# EAGLE design Cargador_RasPi3HAT_CamSlot_v1.1 (EAGLE 9.3.0)
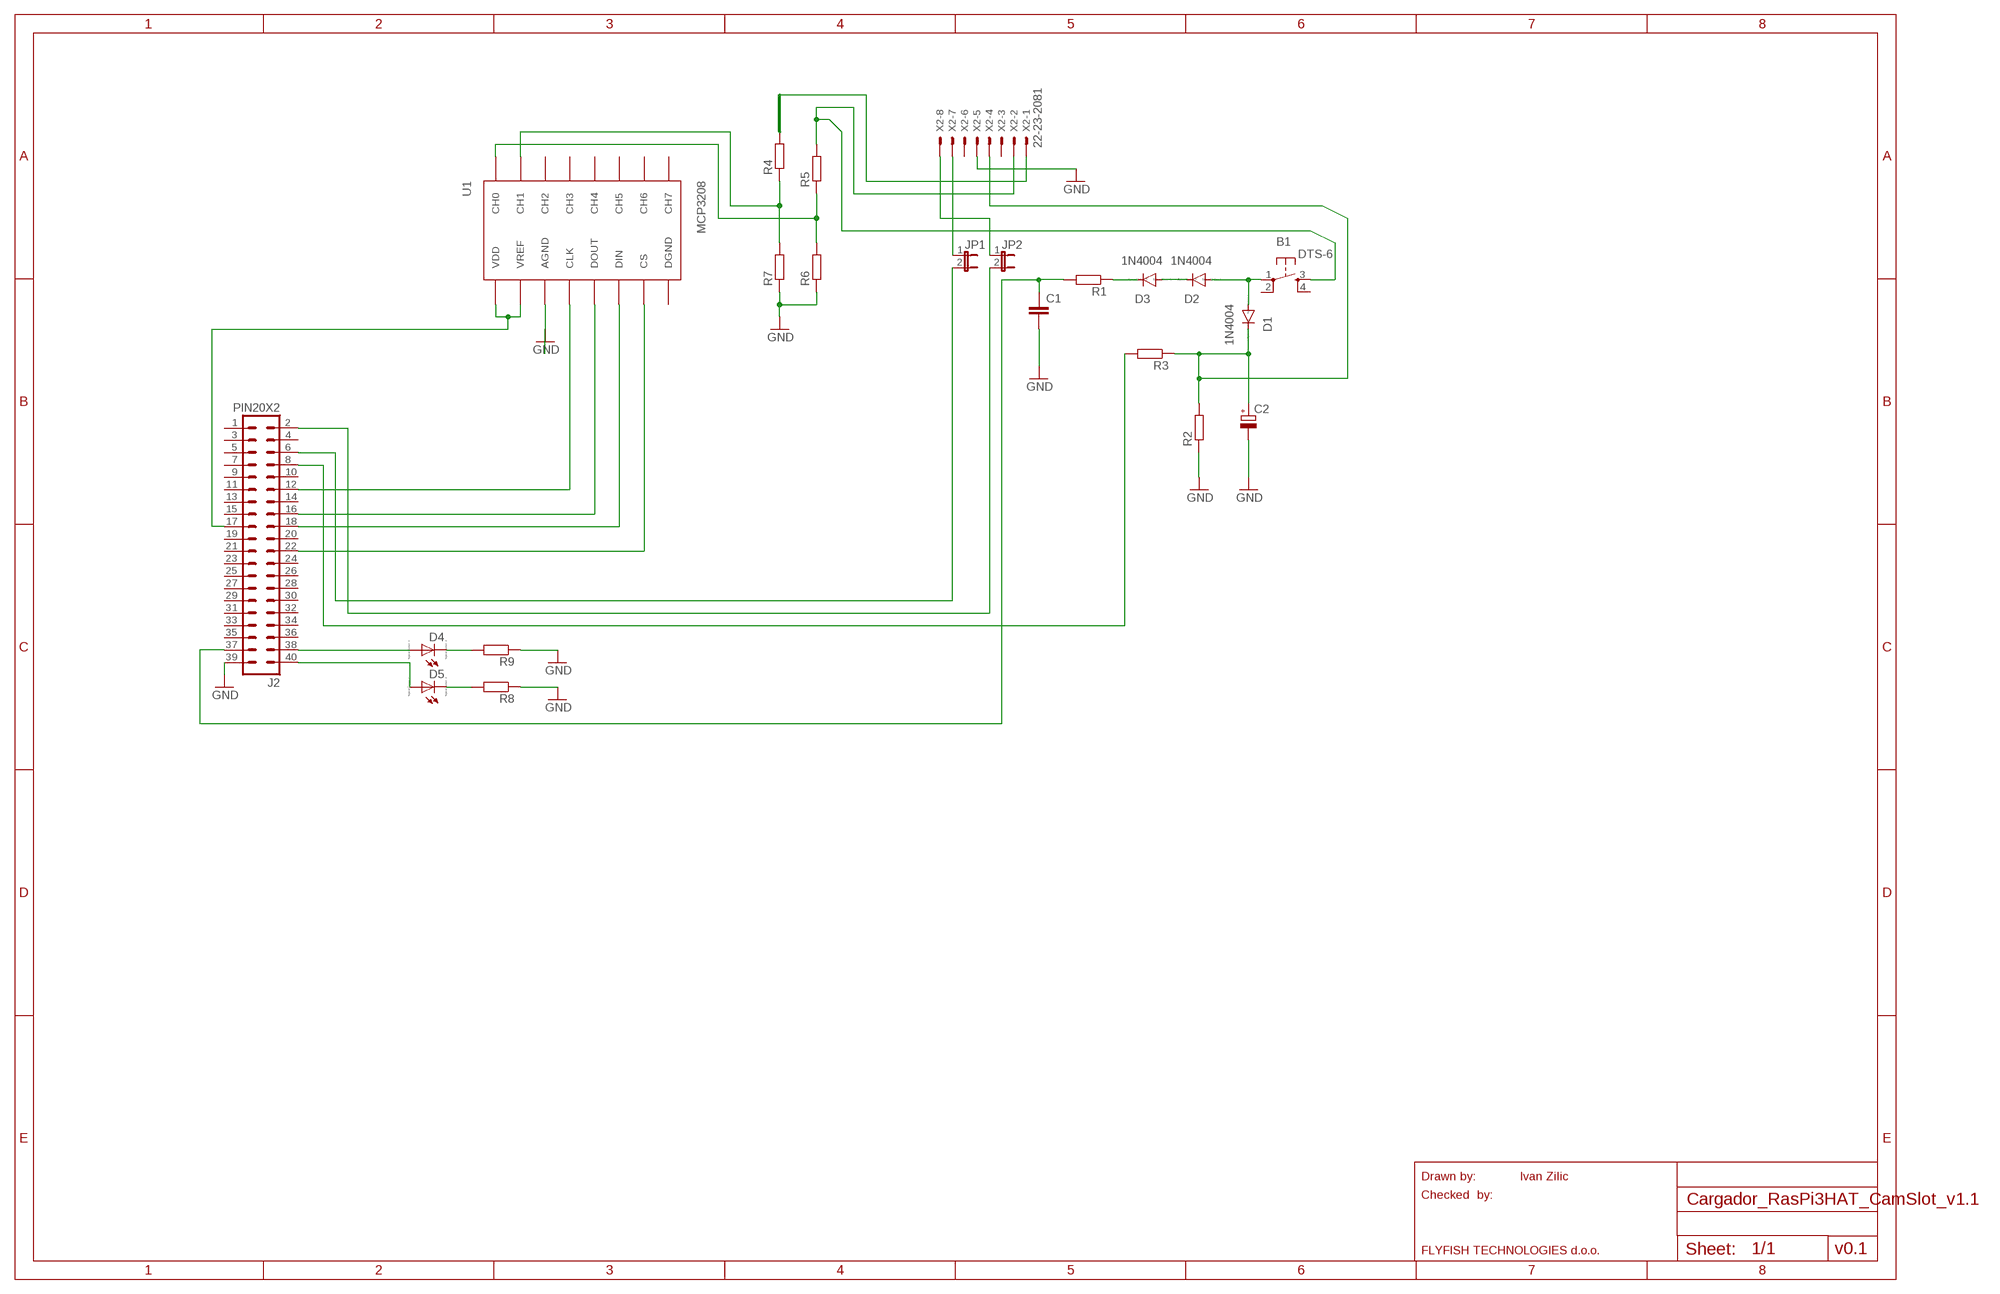
[diagram p0: schematic, sheet 1]

## Parts
B1  DTS-6  [DTS-6]
C1  C2.5/2  [C2.5-2]
C2  CPOL-EUE5-4  [E5-4]
D1  1N4004  [DO41-10]
D2  1N4004  [DO41-10]
D3  1N4004  [DO41-10]
D4  LED_ELD260  [LED_LD260]
D5  LED_ELD260  [LED_LD260]
J2  PIN20X2  [PIN_20X2]
JP1  JP1E  [JP1]
JP2  JP1E  [JP1]
R1  R-EU_0207/10  [0207/10]
R2  R-EU_0207/10  [0207/10]
R3  R-EU_0207/10  [0207/10]
R4  R-EU_0207/10  [0207/10]
R5  R-EU_0207/10  [0207/10]
R6  R-EU_0207/10  [0207/10]
R7  R-EU_0207/10  [0207/10]
R8  R-EU_0207/10  [0207/10]
R9  R-EU_0207/10  [0207/10]
U1  MCP3208  [DIL16]
X2  22-23-2081  [22-23-2081]

## Nets
GND [GND]: C1.2 C2.- J2.39 R2.1 R6.1 R7.1 R8.1 R9.1 U1.AGND X2.5
N$1: J2.6 JP1.2
N$2: J2.8 R3.2
N$3: D4.K(C) R9.2
N$4: D5.K(C) R8.2
N$5: D3.C R1.1
N$6: D4.A J2.38
N$7: D5.A J2.40
N$8: J2.22 U1.CS
N$9: J2.16 U1.DOUT
N$10: J2.18 U1.DIN
N$11 [GND]: J2.12 U1.CLK
N$12: J2.17 U1.VDD U1.VREF
N$13 [GND]: R4.1 R7.2 U1.CH1
N$14: R5.1 R6.2 U1.CH0
N$15: R4.2 X2.1
N$16 [GND]: B1.3 R5.2 X2.2
N$17: JP1.1 X2.7
N$19: JP2.1 X2.8
N$20: J2.2 JP2.2
N$21: C1.1 J2.37 R1.2
N$23: D2.C D3.A
N$24 [GND]: B1.1 D1.A D2.A
N$26 [GND]: C2.+ D1.C R2.2 R3.1 X2.4
Unconnected: B1.2 B1.4 J2.1 J2.3 J2.4 J2.5 J2.7 J2.9 J2.10 J2.11 J2.13 J2.14 J2.15 J2.19 J2.20 J2.21 J2.23 J2.24 J2.25 J2.26 J2.27 J2.28 J2.29 J2.30 J2.31 J2.32 J2.33 J2.34 J2.35 J2.36 U1.CH2 U1.CH3 U1.CH4 U1.CH5 U1.CH6 U1.CH7 X2.3 X2.6

## Notes on the sheet
- Drawn by: | Ivan Zilic
- Checked  by:
- FLYFISH TECHNOLOGIES d.o.o. | v0.1

## Power pins joined to a net without a drawn wire
DGND: U1.DGND

## Library data of the parts
B1 = switch-tact:DTS-6
C1 = capacitor-wima:C: CAPACITOR naming: grid - package width
C2 = rcl:CPOL-EU: POLARIZED CAPACITOR, European symbol; SPICEPREFIX: C
D1-D3 = diode:1N4004: DIODE general purpose rectifier, 1 A
D4 D5 = eagle-ltspice:LED_E: LED Source: http://www.osram.convergy.de Source: www.luxeon.com Source: www.kingbright.com; SPICEMODEL: NONE; SPICEPREFIX: D; SPICETYPE: diode
J2 = FLYFISH:PIN20X2
JP1 JP2 = jumper:JP1E: JUMPER
R1-R9 = rcl:R-EU_: RESISTOR, European symbol; SPICEPREFIX: R
U1 = mcp3208:MCP3208
X2 = con-molex:22-23-2081: .100" (2.54mm) Center Header - 8 Pin; MF: MOLEX; MPN: 22-23-2081; OC_FARNELL: 1756826; OC_NEWARK: 01C7592

## Net classes
1 GND: width 0.254 mm, clearance 0.127 mm

## Board
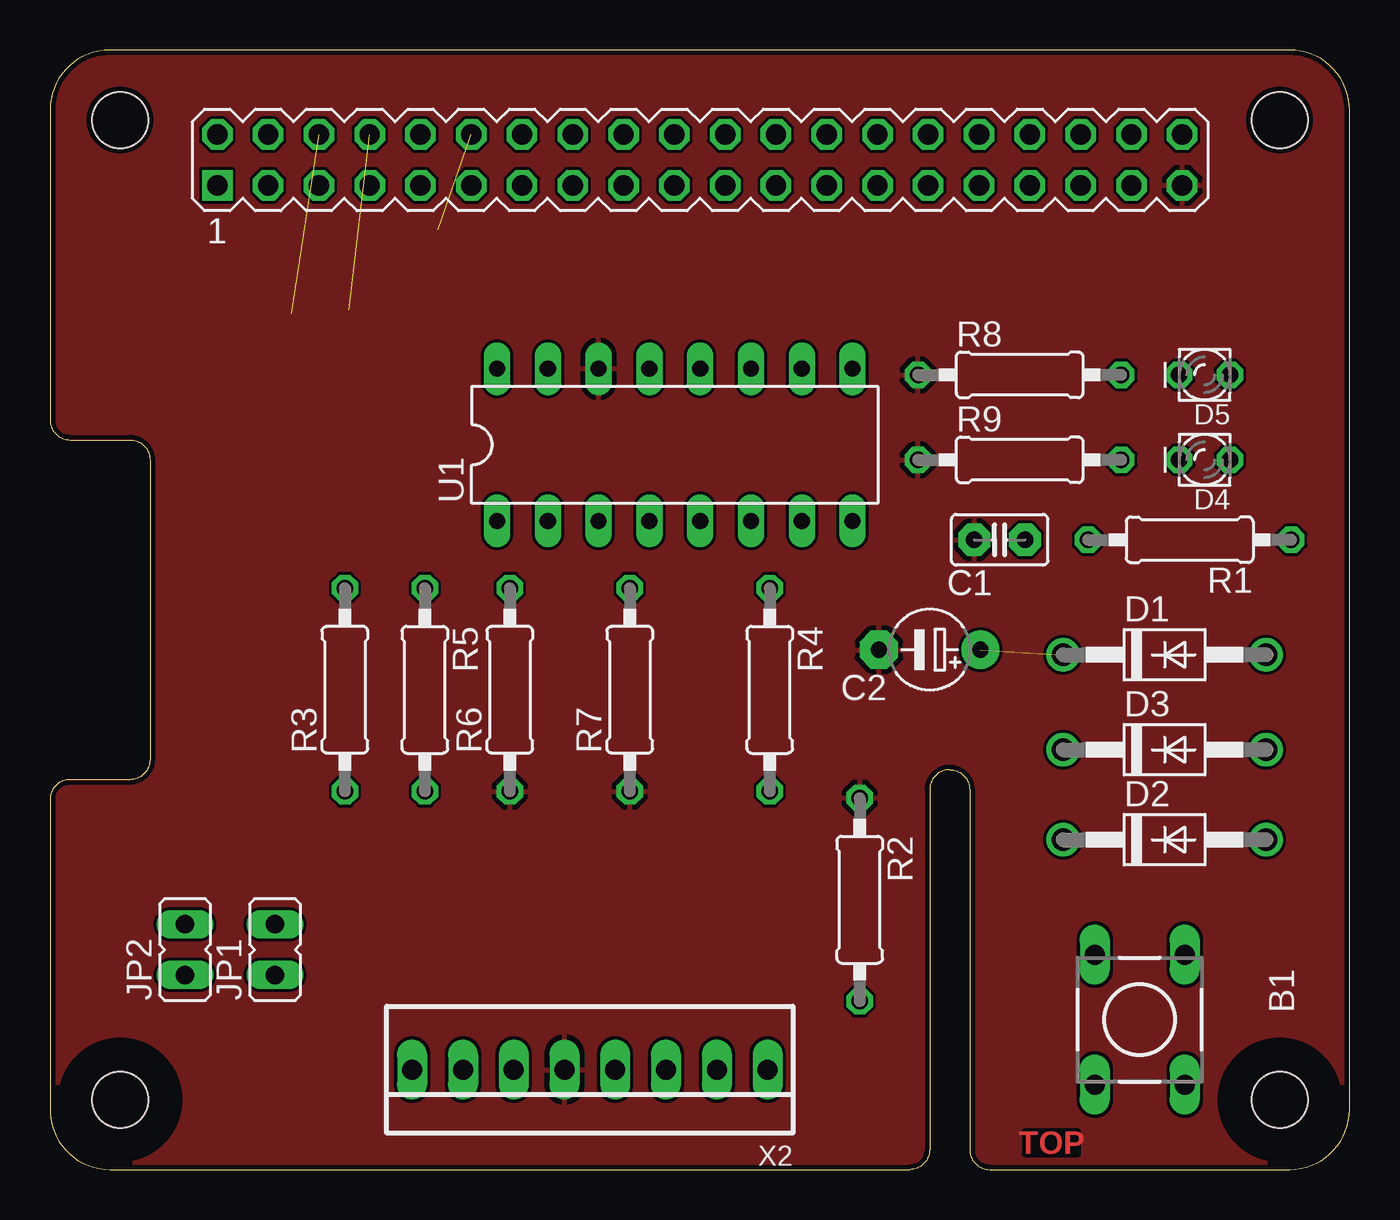
[diagram p1: board, top side]
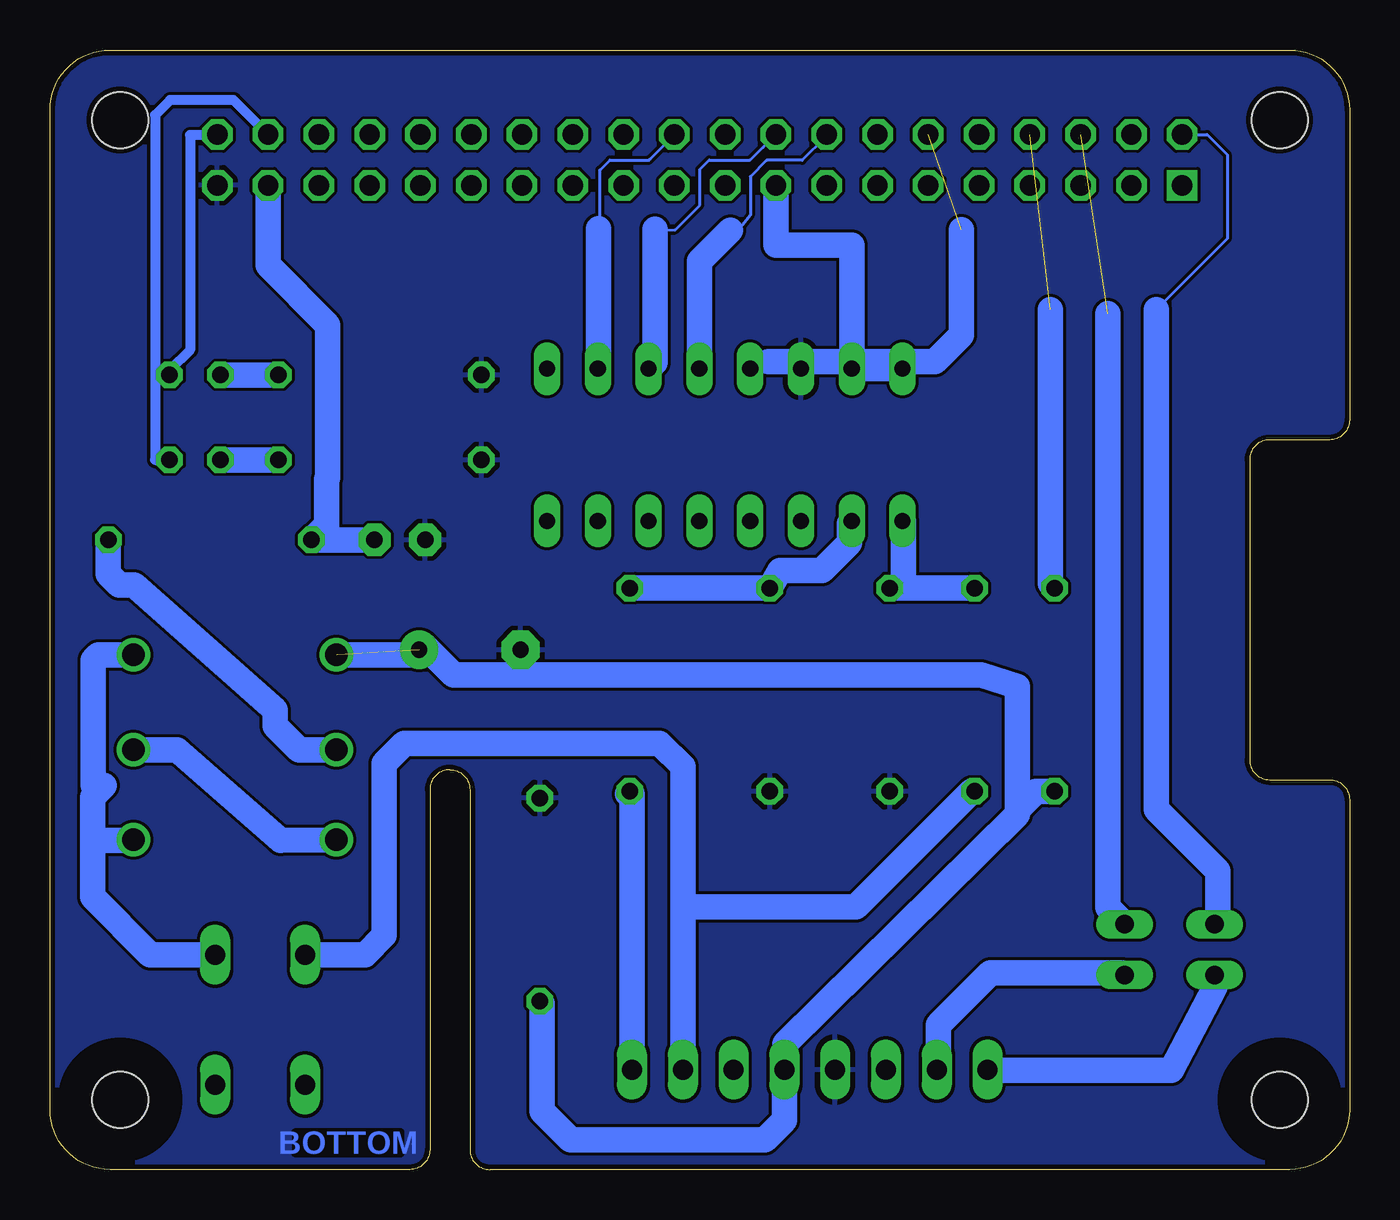
[diagram p2: board, bottom side, seen from below]

Size 65 x 56 mm. Coordinates in mm from the lower left corner, seen from the top.
Outline: 0,3 arc90 3,0 43,0 arc90 44,1 44,19 arc-90 45,20 arc-90 46,19 46,1 arc90 47,0 62,0 arc90 65,3 65,53 arc90 62,56 3,56 arc90 0,53 0,37.5 arc90 1,36.5 4,36.5 arc-90 5,35.5 5,20.5 arc-90 4,19.5 1,19.5 arc90 0,18.5 0,3
Copper layers (1*16): Top 0.035mm / dielectric 1.5mm / Bottom 0.035mm
Design rules "ITEADstudio_DRC": minimum track width 6mil, minimum drill 12mil, track to track 6mil, track to pad 6mil, pad to pad 6mil, via to via 6mil, smd to smd 0mil, copper to edge 10mil, drill to drill 10mil, minimum pad ring 10mil, minimum via ring 6mil, stop-mask expansion 2mil, vias tented up to drill 100mil, thermal gap 10mil
Holes 2.8 mm at 3.5,3.5 3.5,52.5 61.5,52.5 61.5,3.5
tRestrict: area 60,1.9 to 63,5; area 1.9,1.9 to 5,5
bRestrict: area 1.9,1.9 to 5,5; area 60,1.9 to 63,5

### Footprints (pad centres in the part's own frame; a part is rotated, then mirrored left to right if it is on the bottom)
DTS-6 = drill 1 long: 1 -3.25,2.25; 2 3.25,2.25; 3 -3.25,-2.25; 4 3.25,-2.25
C2.5-2 = drill 0.813 pad 1.6 octagon: 1 -1.27,0; 2 1.27,0
E5-4 = drill 0.813 pad 1.905: + -2.54,0 | drill 0.813 pad 1.905 octagon: - 2.54,0
DO41-10 = drill 1.118: A 5.08,0; C -5.08,0
LED_LD260 = drill 0.813 octagon: A -1.27,0; K 1.27,0
PIN_20X2 = drill 1.016 square: 1 -24.13,-1.27 | drill 1.016 octagon: 2 -24.13,1.27; 3 -21.59,-1.27; 4 -21.59,1.27; 5 -19.05,-1.27; 6 -19.05,1.27; 7 -16.51,-1.27; 8 -16.51,1.27; 9 -13.97,-1.27; 10 -13.97,1.27; 11 -11.43,-1.27; 12 -11.43,1.27; 13 -8.89,-1.27; 14 -8.89,1.27; 15 -6.35,-1.27; 16 -6.35,1.27; 17 -3.81,-1.27; 18 -3.81,1.27; 19 -1.27,-1.27; 20 -1.27,1.27; 21 1.27,-1.27; 22 1.27,1.27; 23 3.81,-1.27; 24 3.81,1.27; 25 6.35,-1.27; 26 6.35,1.27; 27 8.89,-1.27; 28 8.89,1.27; 29 11.43,-1.27; 30 11.43,1.27; 31 13.97,-1.27; 32 13.97,1.27; 33 16.51,-1.27; 34 16.51,1.27; 35 19.05,-1.27; 36 19.05,1.27; 37 21.59,-1.27; 38 21.59,1.27; 39 24.13,-1.27; 40 24.13,1.27
JP1 = drill 0.914 long: 1 0,-1.27; 2 0,1.27
0207/10 = drill 0.813 octagon: 1 -5.08,0; 2 5.08,0
DIL16 = drill 0.813 long: AGND -3.81,3.81; CH0 -8.89,-3.81; CH1 -6.35,-3.81; CH2 -3.81,-3.81; CH3 -1.27,-3.81; CH4 1.27,-3.81; CH5 3.81,-3.81; CH6 6.35,-3.81; CH7 8.89,-3.81; CLK -1.27,3.81; CS 6.35,3.81; DGND 8.89,3.81; DIN 3.81,3.81; DOUT 1.27,3.81; VDD -8.89,3.81; VREF -6.35,3.81
22-23-2081 = drill 1 long: 1 -8.89,0; 2 -6.35,0; 3 -3.81,0; 4 -1.27,0; 5 1.27,0; 6 3.81,0; 7 6.35,0; 8 8.89,0

### Placement (x,y rotation side)
B1  54.5,7.5 270 top
C1  47.5,31.5 180 top
C2  44,26 180 top
D1  55.75,25.75 0 top
D2  55.75,16.5 0 top
D3  55.75,21 0 top
D4  57.75,35.5 180 top
D5  57.75,39.75 180 top
J2  32.5,50.5 0 top
JP1  11.25,11 0 top
JP2  6.75,11 0 top
R1  57,31.5 180 top
R2  40.5,13.5 270 top
R3  14.75,24 90 top
R4  36,24 270 top
R5  18.75,24 270 top
R6  23,24 90 top
R7  29,24 90 top
R8  48.5,39.75 0 top
R9  48.5,35.5 0 top
U1  31.25,36.25 0 top
X2  27,5 180 top

### Tracks (layer width: path | path; a pad name or v marks a point on that pad's centre or on a via)
GND
  pour Bottom: 0,3 arc90 3,0 43,0 arc90 44,1 44,19 arc-90 45,20 arc-90 46,19 46,1 arc90 47,0 62,0 arc90 65,3 65,53 arc90 62,56 3,56 arc90 0,53 0,37.5 arc90 1,36.5 4,36.5 arc-90 5,35.5 5,20.5 arc-90 4,19.5 1,19.5 arc90 0,18.5
  pour Top: 0,3 arc90 3,0 43,0 arc90 44,1 44,19 arc-90 45,20 arc-90 46,19 46,1 arc90 47,0 62,0 arc90 65,3 65,53 arc90 62,56 3,56 arc90 0,53 0,37.5 arc90 1,36.5 4,36.5 arc-90 5,35.5 5,20.5 arc-90 4,19.5 1,19.5 arc90 0,18.5
N$1  (1 unrouted)
  Bottom 1.27: 12.09,42.82 12.09,13.11 JP1.2
N$2  (1 unrouted)
  Bottom 1.27: 14.97,43 14.97,29.3 R3.2
N$3
  Bottom 1.27: R9.2 D4.K
N$4
  Bottom 1.27: R8.2 D5.K
N$5
  Bottom 1.27: D3.C 52.55,21 53.75,22.2 53.75,23 60.78,29.25 61.55,29.25 62.08,29.78 R1.1
N$6
  Bottom 0.508: J2.38 55.82,53.5 59,53.5 59.75,52.75 59.75,35.5 D4.A
N$7
  Bottom 0.152: J2.40 56.65,51.75 | 59.02,39.98 D5.A
  Bottom 0.508: 59.02,39.98 58,41 58,51.75 56.65,51.75
N$8
  Bottom 0.152: 37.55,47.05 37.5,46.94 37.5,50 37,50.5 35.02,50.5 35.02,50.52 J2.22
  Bottom 1.27: 37.55,47.05 37.55,40.11 U1.CS
N$9
  Bottom 0.152: 30.97,47 30.55,47 29.97,47.75 29.97,49.66 29.15,50.48 27.38,50.48 26.21,51.65 J2.16
  Bottom 1.27: 30.97,47 32.52,45.45 U1.DOUT
N$10
  Bottom 0.152: 34.75,47.03 33.75,47 32.5,48.25 32.5,50.03 32.03,50.5 30,50.5 29.33,51.13 J2.18
  Bottom 1.27: 34.75,47.03 34.75,40.37 U1.DIN
N$11  (1 unrouted)
  Bottom 0.152: U1.CLK 29.09,40.06 29.07,40.42
  Bottom 1.27: 29.07,40.42 20.73,40.42 19.41,41.74 19.41,47.02
N$12
  Bottom 1.27: J2.17 28.69,46.25 24.9,46.25 U1.VREF U1.VDD
N$13
  Bottom 1.27: U1.CH1 25.02,32.32 25.02,31.33 26.4,29.95 28.5,29.95 R7.2 R4.1
N$14
  Bottom 0.152: 22.31,32.44 U1.CH0
  Bottom 1.27: 22.31,29.08 R6.2 | 22.31,32.44 22.31,29.08 | R5.1 22.31,29.08
N$15
  Bottom 0.152: 36.12,18.79 R4.2
  Bottom 1.27: 36.12,18.79 36.01,18.9 35.89,18.78 X2.1
N$16
  Bottom 0.152: 18.75,18.95 R5.2
  Bottom 1.27: 18.75,18.95 18.88,18.95 24.68,13.14 33.34,13.14 | 33.34,13.14 33.34,20.15 34.51,21.32 47.28,21.32 48.29,20.31 48.29,11.71 49.25,10.75 B1.3 | 33.34,13.14 33.34,6.25 33.35,6.25 X2.2
N$17
  Bottom 0.152: 20.57,5.01 X2.7
  Bottom 1.27: JP1.1 11.35,9.83 17.97,9.83 20.57,7.23 20.57,5.01
N$19
  Bottom 0.152: X2.8 18.08,4.97
  Bottom 1.27: 18.08,4.97 8.92,4.97 6.75,9.12 JP2.1
N$20
  Bottom 0.152: JP2.2 6.58,12.44 | 9.66,43.02 6.12,46.56 6.12,50.77 7.12,51.77 J2.2
  Bottom 1.27: 6.58,12.44 6.58,14.94 9.66,18.01 9.66,43.02
N$21
  Bottom 0.152: 51.82,31.48 R1.2 | 48.83,31.48 C1.1
  Bottom 1.27: 48.83,31.48 51.82,31.48 | J2.37 54.09,45.23 51.1,42.24 51.1,34.61 51.17,34.54 51.17,32.25 R1.2
N$23
  Bottom 1.27: D3.A 58.63,21 53.45,16.47 D2.C
N$24
  Bottom 1.27: 62.86,16.47 62.86,18.64 62.28,19.22 62.83,19.22 62.83,25.5 62.58,25.75 D1.A | 62.86,16.47 62.86,13.64 59.98,10.75 B1.1 | D2.A 60.86,16.47 62.86,16.47
N$26  (1 unrouted)
  Bottom 1.27: R2.2 40.4,8.31 40.4,2.92 38.98,1.5 29.23,1.5 28.27,2.46 X2.4 28.24,5.03 28.24,6.28 16.62,17.76 16.62,18 | 16.62,18 16.62,24.16 18.42,24.75 44.81,24.75 46.3,26.24 C2.+ 46.79,25.75 D1.C | R3.1 15.7,18.92 16.62,18

### Text on the board
Top: TOP
Bottom: BOTTOM